# Altium project PCB_Project.PrjPcb
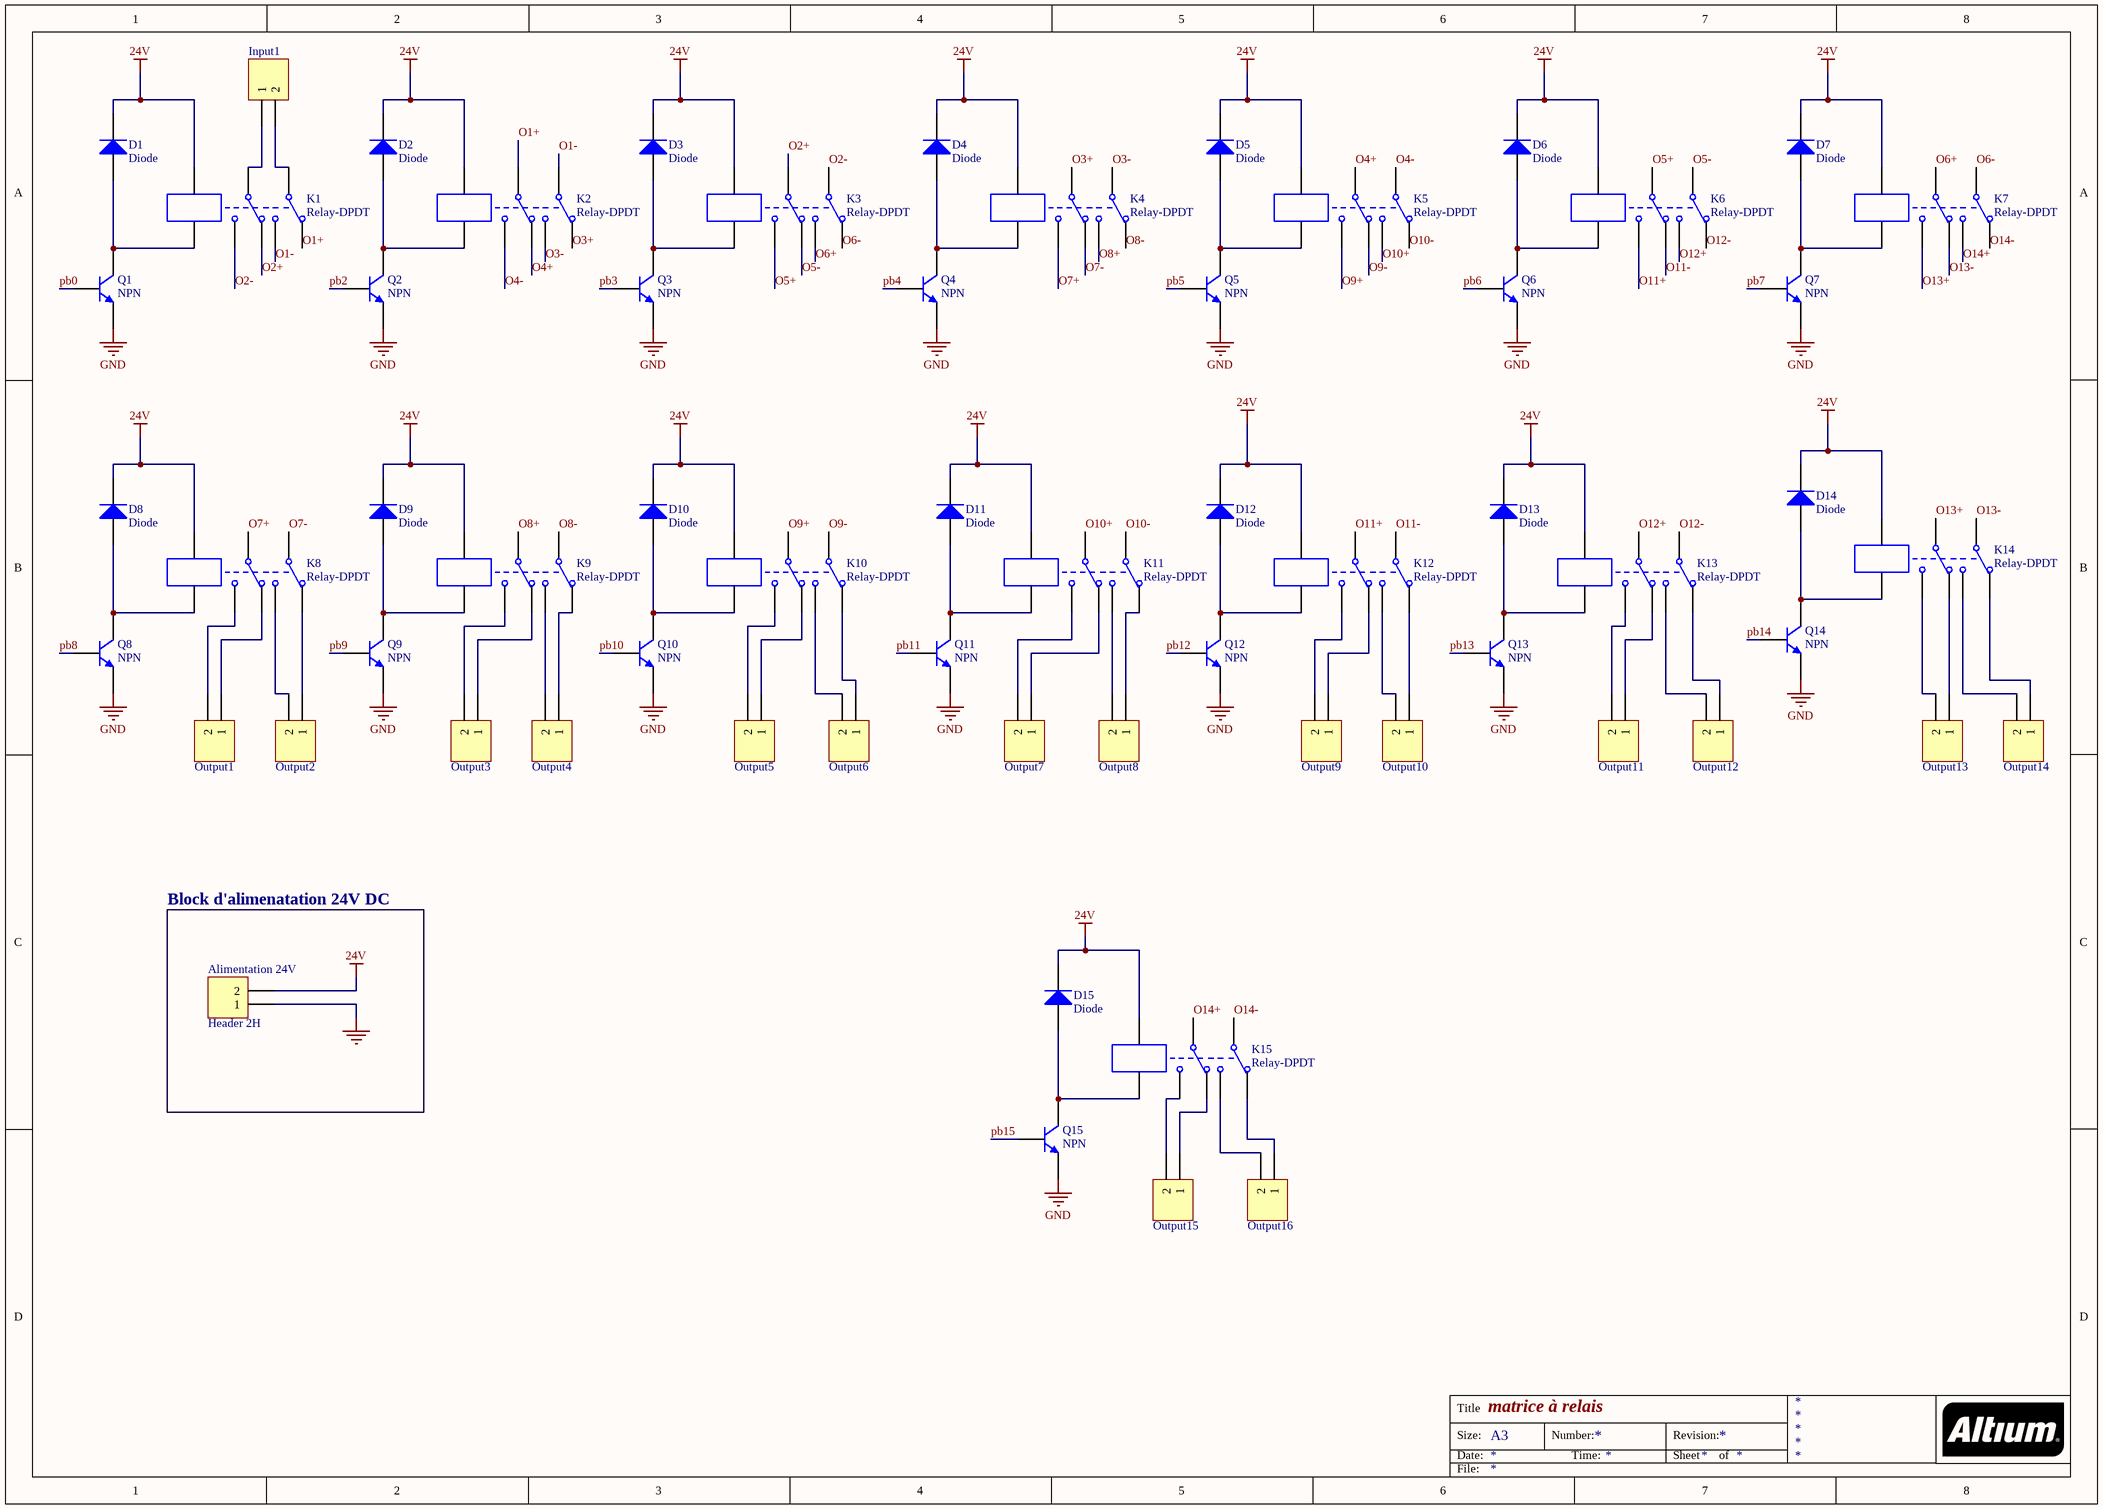
[diagram p0: martice_relais.SchDoc]
4 sheets, 115 parts. Net scope: global (net labels, ports and power ports of the same name join across sheets).
Sheets:
  martice_relais.SchDoc
  MCU.SchDoc
  enc28j60.SchDoc
  MCU2.SchDoc

## Sheet martice_relais.SchDoc: matrice à relais
size A3

### Parts
Alimentation_24V  Header 2H  [HDR1X2H]
D1  Diode  [SMC]
D2  Diode  [SMC]
D3  Diode  [SMC]
D4  Diode  [SMC]
D5  Diode  [SMC]
D6  Diode  [SMC]
D7  Diode  [SMC]
D8  Diode  [SMC]
D9  Diode  [SMC]
D10  Diode  [SMC]
D11  Diode  [SMC]
D12  Diode  [SMC]
D13  Diode  [SMC]
D14  Diode  [SMC]
D15  Diode  [SMC]
Input1  Header 2H  [HDR1X2H]  (value not drawn)
K1  Relay-DPDT  [DIP-P8]
K2  Relay-DPDT  [DIP-P8]
K3  Relay-DPDT  [DIP-P8]
K4  Relay-DPDT  [DIP-P8]
K5  Relay-DPDT  [DIP-P8]
K6  Relay-DPDT  [DIP-P8]
K7  Relay-DPDT  [DIP-P8]
K8  Relay-DPDT  [DIP-P8]
K9  Relay-DPDT  [DIP-P8]
K10  Relay-DPDT  [DIP-P8]
K11  Relay-DPDT  [DIP-P8]
K12  Relay-DPDT  [DIP-P8]
K13  Relay-DPDT  [DIP-P8]
K14  Relay-DPDT  [DIP-P8]
K15  Relay-DPDT  [DIP-P8]
Output1  Header 2H  [HDR1X2H]  (value not drawn)
Output2  Header 2H  [HDR1X2H]  (value not drawn)
Output3  Header 2H  [HDR1X2H]  (value not drawn)
Output4  Header 2H  [HDR1X2H]  (value not drawn)
Output5  Header 2H  [HDR1X2H]  (value not drawn)
Output6  Header 2H  [HDR1X2H]  (value not drawn)
Output7  Header 2H  [HDR1X2H]  (value not drawn)
Output8  Header 2H  [HDR1X2H]  (value not drawn)
Output9  Header 2H  [HDR1X2H]  (value not drawn)
Output10  Header 2H  [HDR1X2H]  (value not drawn)
Output11  Header 2H  [HDR1X2H]  (value not drawn)
Output12  Header 2H  [HDR1X2H]  (value not drawn)
Output13  Header 2H  [HDR1X2H]  (value not drawn)
Output14  Header 2H  [HDR1X2H]  (value not drawn)
Output15  Header 2H  [HDR1X2H]  (value not drawn)
Output16  Header 2H  [HDR1X2H]  (value not drawn)
Q1  NPN  [TO-226-AA]
Q2  NPN  [TO-226-AA]
Q3  NPN  [TO-226-AA]
Q4  NPN  [TO-226-AA]
Q5  NPN  [TO-226-AA]
Q6  NPN  [TO-226-AA]
Q7  NPN  [TO-226-AA]
Q8  NPN  [TO-226-AA]
Q9  NPN  [TO-226-AA]
Q10  NPN  [TO-226-AA]
Q11  NPN  [TO-226-AA]
Q12  NPN  [TO-226-AA]
Q13  NPN  [TO-226-AA]
Q14  NPN  [TO-226-AA]
Q15  NPN  [TO-226-AA]

### Blocks framed on the sheet
Block d'alimenatation 24V DC: Alimentation_24V

### Nets
24V: Alimentation_24V.2 D1.2(K) D2.2(K) D3.2(K) D4.2(K) D5.2(K) D6.2(K) D7.2(K) D8.2(K) D9.2(K) D10.2(K) D11.2(K) D12.2(K) D13.2(K) D14.2(K) D15.2(K) K1.7 K2.7 K3.7 K4.7 K5.7 K6.7 K7.7 K8.7 K9.7 K10.7 K11.7 K12.7 K13.7 K14.7 K15.7
GND: Q1.3(E) Q2.3(E) Q3.3(E) Q4.3(E) Q5.3(E) Q6.3(E) Q7.3(E) Q8.3(E) Q9.3(E) Q10.3(E) Q11.3(E) Q12.3(E) Q13.3(E) Q14.3(E) Q15.3(E)
VCC: Alimentation_24V.1
O1+: K1.2 K2.4
O1-: K1.3 K2.1
O2+: K1.5 K3.4
O2-: K1.6 K3.1
O3+: K2.2 K4.4
O3-: K2.3 K4.1
O4+: K2.5 K5.4
O4-: K2.6 K5.1
O5+: K3.6 K6.4
O5-: K3.5 K6.1
O6+: K3.3 K7.4
O6-: K3.2 K7.1
O7+: K4.6 K8.4
O7-: K4.5 K8.1
O8+: K4.3 K9.4
O8-: K4.2 K9.1
O9+: K5.6 K10.4
O9-: K5.5 K10.1
O10+: K5.3 K11.4
O10-: K5.2 K11.1
O11+: K6.6 K12.4
O11-: K6.5 K12.1
O12+: K6.3 K13.4
O12-: K6.2 K13.1
O13+: K7.6 K14.4
O13-: K7.5 K14.1
O14+: K7.3 K15.4
O14-: K7.2 K15.1
pb0: Q1.2(B)
pb2: Q2.2(B)
pb3: Q3.2(B)
pb4: Q4.2(B)
pb5: Q5.2(B)
pb6: Q6.2(B)
pb7: Q7.2(B)
pb8: Q8.2(B)
pb9: Q9.2(B)
pb10: Q10.2(B)
pb11: Q11.2(B)
pb12: Q12.2(B)
pb13: Q13.2(B)
pb14: Q14.2(B)
pb15: Q15.2(B)
NetD1_1: D1.1(A) K1.8 Q1.1(C)
NetD2_1: D2.1(A) K2.8 Q2.1(C)
NetD3_1: D3.1(A) K3.8 Q3.1(C)
NetD4_1: D4.1(A) K4.8 Q4.1(C)
NetD5_1: D5.1(A) K5.8 Q5.1(C)
NetD6_1: D6.1(A) K6.8 Q6.1(C)
NetD7_1: D7.1(A) K7.8 Q7.1(C)
NetD8_1: D8.1(A) K8.8 Q8.1(C)
NetD9_1: D9.1(A) K9.8 Q9.1(C)
NetD10_1: D10.1(A) K10.8 Q10.1(C)
NetD11_1: D11.1(A) K11.8 Q11.1(C)
NetD12_1: D12.1(A) K12.8 Q12.1(C)
NetD13_1: D13.1(A) K13.8 Q13.1(C)
NetD14_1: D14.1(A) K14.8 Q14.1(C)
NetD15_1: D15.1(A) K15.8 Q15.1(C)
NetInput1_1: Input1.1 K1.4
NetInput1_2: Input1.2 K1.1
NetK8_2: K8.2 Output2.1
NetK8_3: K8.3 Output2.2
NetK8_5: K8.5 Output1.1
NetK8_6: K8.6 Output1.2
NetK9_2: K9.2 Output4.1
NetK9_3: K9.3 Output4.2
NetK9_5: K9.5 Output3.1
NetK9_6: K9.6 Output3.2
NetK10_2: K10.2 Output6.1
NetK10_3: K10.3 Output6.2
NetK10_5: K10.5 Output5.1
NetK10_6: K10.6 Output5.2
NetK11_2: K11.2 Output8.1
NetK11_3: K11.3 Output8.2
NetK11_5: K11.5 Output7.1
NetK11_6: K11.6 Output7.2
NetK12_2: K12.2 Output10.1
NetK12_3: K12.3 Output10.2
NetK12_5: K12.5 Output9.1
NetK12_6: K12.6 Output9.2
NetK13_2: K13.2 Output12.1
NetK13_3: K13.3 Output12.2
NetK13_5: K13.5 Output11.1
NetK13_6: K13.6 Output11.2
NetK14_2: K14.2 Output14.1
NetK14_3: K14.3 Output14.2
NetK14_5: K14.5 Output13.1
NetK14_6: K14.6 Output13.2
NetK15_2: K15.2 Output16.1
NetK15_3: K15.3 Output16.2
NetK15_5: K15.5 Output15.1
NetK15_6: K15.6 Output15.2

### Notes on the sheet
- Title
- Size:
- Date:
- A3
- Number:
- Time:
- Revision:
- Sheet
- of
- File:

### Library data of the parts
Alimentation_24V Input1 Output1-Output16 = Header 2H: Header, 2-Pin, Right Angle; LatestRevisionDate: 17-Jul-2002; LatestRevisionNote: Re-released for DXP Platform.; Publisher: Altium Limited
D1-D15 = Diode: Default Diode; Published: 8-Jun-2000; LatestRevisionDate: 17-Jul-2002; LatestRevisionNote: Re-released for DXP Platform.; PackageVersion: Sep-1996; PackageReference: SMC; Publisher: Altium Limited; PackageDescription: DO-214-AB/SMC; 2 C-Bend Leads; Body 7.9 x 5.9 mm, inc. leads (LxW); Code_JEDEC: DO-214-AB
K1-K15 = Relay-DPDT: Dual-Pole Dual-Throw Relay; Published: 24-Mar-1999; LatestRevisionDate: 17-Jul-2002; LatestRevisionNote: Re-released for DXP Platform.; PackageReference: DIP-P8; Publisher: Altium Limited; PackageDescription: Relay; 8 Leads
Q1-Q15 = NPN: NPN Bipolar Transistor; Published: 8-Jun-2000; LatestRevisionDate: 17-Jul-2002; LatestRevisionNote: Re-released for DXP Platform.; PackageReference: TO-226-AA; Publisher: Altium Limited; PackageDescription: TO, Flat Index; 3 In-Line, Axial Leads; Body Dia. 4.8mm; Leads 0.55 x 0.51 mm (max); Code_JEDEC: TO-226-AA

## Sheet MCU.SchDoc: MCU_STM32F407VGT6
size A3
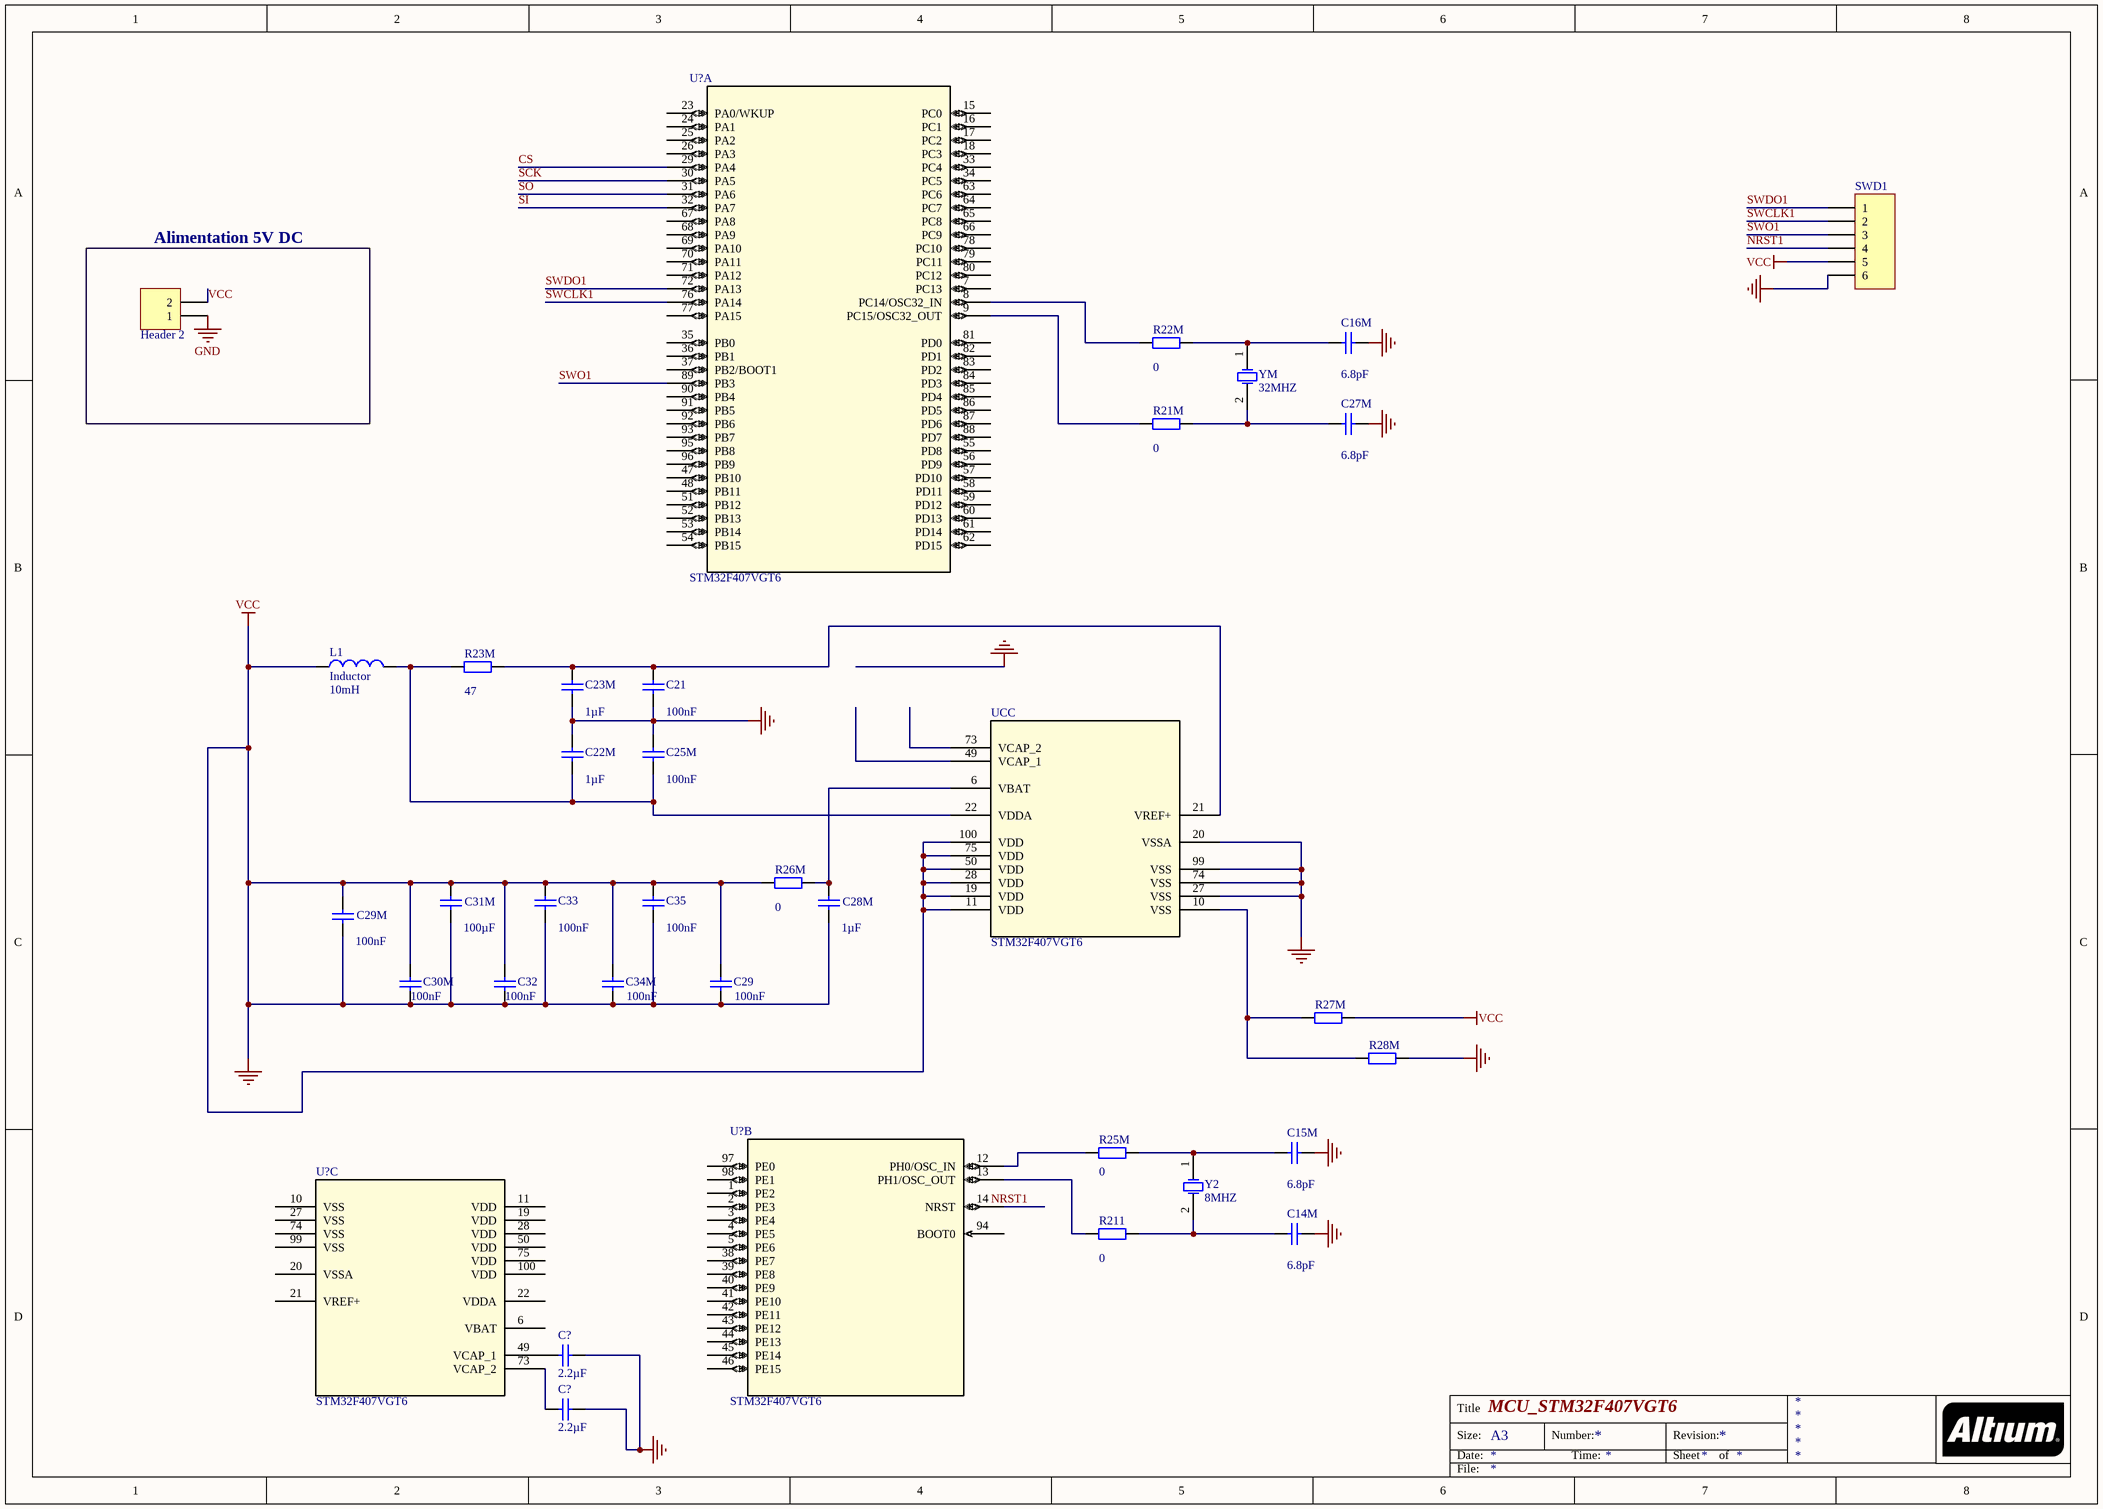
[diagram p1: MCU.SchDoc]

### Parts
(Parts that share a designator on the sheet are numbered #1, #2 ... from top to bottom, then left to right.)
Alimentation_5V_DC  Header 2  [HDR1X2]
C14M  value 6.8pF  [RAD-0.3]  (hidden comment: Cap)
C15M  value 6.8pF  [RAD-0.3]  (hidden comment: Cap)
C16M  value 6.8pF  [RAD-0.3]  (hidden comment: Cap)
C21  value 100nF  [RAD-0.3]  (hidden comment: Cap)
C22M  value 1µF  [RAD-0.3]  (hidden comment: Cap)
C23M  value 1µF  [RAD-0.3]  (hidden comment: Cap)
C25M  value 100nF  [RAD-0.3]  (hidden comment: Cap)
C27M  value 6.8pF  [RAD-0.3]  (hidden comment: Cap)
C28M  value 1µF  [RAD-0.3]  (hidden comment: Cap)
C29  value 100nF  [RAD-0.3]  (hidden comment: Cap)
C29M  value 100nF  [RAD-0.3]  (hidden comment: Cap)
C30M  value 100nF  [RAD-0.3]  (hidden comment: Cap)
C31M  value 100µF  [RAD-0.3]  (hidden comment: Cap)
C32  value 100nF  [RAD-0.3]  (hidden comment: Cap)
C33  value 100nF  [RAD-0.3]  (hidden comment: Cap)
C34M  value 100nF  [RAD-0.3]  (hidden comment: Cap)
C35  value 100nF  [RAD-0.3]  (hidden comment: Cap)
C?#1  value 2.2µF  [RAD-0.3]  (hidden comment: Cap)
C?#2  value 2.2µF  [RAD-0.3]  (hidden comment: Cap)
L1  Inductor  value 10mH  [0402-A]
R21M  value 0  [AXIAL-0.4]  (hidden comment: Res2)
R22M  value 0  [AXIAL-0.4]  (hidden comment: Res2)
R23M  value 47  [AXIAL-0.4]  (hidden comment: Res2)
R25M  value 0  [AXIAL-0.4]  (hidden comment: Res2)
R26M  value 0  [AXIAL-0.4]  (hidden comment: Res2)
R27M  Res2  [AXIAL-0.4]  (value not drawn)
R28M  Res2  [AXIAL-0.4]  (value not drawn)
R211  value 0  [AXIAL-0.4]  (hidden comment: Res2)
SWD1  Header 6H  [HDR1X6H]  (value not drawn)
U?#1  STM32F407VGT6  [LQFP100-14x14mm]  (part A of 3)
U?#2  STM32F407VGT6  [LQFP100-14x14mm]  (part B of 3)
U?#3  STM32F407VGT6  [LQFP100-14x14mm]  (part C of 3)
UC  STM32F407VGT6  [LQFP100-14x14mm]  (part C of 3)
Y2  8MHZ  [R38]
YM  32MHZ  [R38]

### Nets
GND: Alimentation_5V_DC.1
VCC: Alimentation_5V_DC.2 C14M.1 C15M.1 C16M.1 C21.1 C22M.2 C23M.1 C25M.2 C27M.1 C28M.1 C29.1 C29.2 C29M.1 C29M.2 C30M.1 C30M.2 C31M.1 C31M.2 C32.1 C32.2 C33.1 C33.2 C34M.1 C34M.2 C35.1 C35.2 C?#1.1 C?#2.1 L1.1 R26M.1 R27M.2 R28M.1 SWD1.5 SWD1.6 UC.11(VDD) UC.19(VDD) UC.20(VSSA) UC.27(VSS) UC.28(VDD) UC.50(VDD) UC.74(VSS) UC.75(VDD) UC.99(VSS) UC.100(VDD)
CS: U?#1.29(PA4)
NRST1: SWD1.4
SCK: U?#1.30(PA5)
SI: U?#1.32(PA7)
SO: U?#1.31(PA6)
SWCLK1: SWD1.2 U?#1.76(PA14)
SWDO1: SWD1.1 U?#1.72(PA13)
SWO1: SWD1.3 U?#1.89(PB3)
NetC14M_2: C14M.2 R211.2 Y2.2(OSC2)
NetC15M_2: C15M.2 R25M.2 Y2.1(OSC1)
NetC16M_2: C16M.2 R22M.2 YM.1(OSC1)
NetC21_2: C21.2 C23M.2 R23M.2 UC.21(VREF+)
NetC22M_1: C22M.1 C25M.1 L1.2 R23M.1 UC.22(VDDA)
NetC27M_2: C27M.2 R21M.2 YM.2(OSC2)
NetC28M_2: C28M.2 R26M.2 UC.6(VBAT)
NetC?#1_2: C?#1.2 U?#3.49(VCAP_1)
NetC?#2_2: C?#2.2 U?#3.73(VCAP_2)
NetR21M_1: R21M.1 U?#1.9(PC15/OSC32_OUT)
NetR22M_1: R22M.1 U?#1.8(PC14/OSC32_IN)
NetR25M_1: R25M.1 U?#2.12(PH0/OSC_IN)
NetR27M_1: R27M.1 R28M.2 UC.10(VSS)
NetR211_1: R211.1 U?#2.13(PH1/OSC_OUT)

Not connected (* = marked no-connect by the designer): U?#1 7(PC13) 15(PC0) 16(PC1) 17(PC2) 18(PC3) 23(PA0/WKUP) 24(PA1) 25(PA2) 26(PA3) 33(PC4) 34(PC5) 35(PB0) 36(PB1) 37(PB2/BOOT1) 47(PB10) 48(PB11) 51(PB12) 52(PB13) 53(PB14) 54(PB15) 55(PD8) 56(PD9) 57(PD10) 58(PD11) 59(PD12) 60(PD13) 61(PD14) 62(PD15) 63(PC6) 64(PC7) 65(PC8) 66(PC9) 67(PA8) 68(PA9) 69(PA10) 70(PA11) 71(PA12) 77(PA15) 78(PC10) 79(PC11) 80(PC12) 81(PD0) 82(PD1) 83(PD2) 84(PD3) 85(PD4) 86(PD5) 87(PD6) 88(PD7) 90(PB4) 91(PB5) 92(PB6) 93(PB7) 95(PB8) 96(PB9); U?#2 1(PE2) 2(PE3) 3(PE4) 4(PE5) 5(PE6) 14(NRST) 38(PE7) 39(PE8) 40(PE9) 41(PE10) 42(PE11) 43(PE12) 44(PE13) 45(PE14) 46(PE15) 94(BOOT0) 97(PE0) 98(PE1); U?#3 6(VBAT) 10(VSS) 11(VDD) 19(VDD) 20(VSSA) 21(VREF+) 22(VDDA) 27(VSS) 28(VDD) 50(VDD) 74(VSS) 75(VDD) 99(VSS) 100(VDD); UC 49(VCAP_1) 73(VCAP_2)

### Notes on the sheet
- Labels drawn without touching a wire or pin: NRST1
- Title
- Size:
- Date:
- A3
- Number:
- Time:
- Revision:
- Sheet
- of
- File:

### Library data of the parts
Alimentation_5V_DC = Header 2: Header, 2-Pin; LatestRevisionDate: 17-Jul-2002; LatestRevisionNote: Re-released for DXP Platform.; Publisher: Altium Limited
C14M C15M C16M C21 C22M C23M C25M C27M C28M C29 C29M C30M C31M C32 C33 C34M C35 C?#1 C?#2 = Cap: Capacitor; Published: 8-Jun-2000; LatestRevisionDate: 17-Jul-2002; LatestRevisionNote: Re-released for DXP Platform.; PackageReference: RAD-0.3; Publisher: Altium Limited; PackageDescription: Radial Cap, Thru-Hole; 2 Leads; 0.3 in Pin Spacing
L1 = Inductor: Code_IEC: 1005; Published: 8-Jun-2000; LatestRevisionDate: 29-May-2009; LatestRevisionNote: IPC-7351 Footprint Added.; PackageReference: 0402-A; Publisher: Altium Limited; PackageDescription: Chip Inductor; Code_JEITA: 0402
R21M R22M R23M R25M R26M R27M R28M R211 = Res2: Resistor; Published: 8-Jun-2000; LatestRevisionDate: 17-Jul-2002; LatestRevisionNote: Re-released for DXP Platform.; PackageReference: AXIAL-0.4; Publisher: Altium Limited; PackageDescription: Axial Device, Thru-Hole; 2 Leads; 0.4 in Pin Spacing
SWD1 = Header 6H: Header, 6-Pin, Right Angle; LatestRevisionDate: 17-Jul-2002; LatestRevisionNote: Re-released for DXP Platform.; Publisher: Altium Limited
U?#1-U?#3 UC = STM32F407VGT6: No Description Available; Mfr_Name: STMicroelectronics; RefDes: RefDes; Type: Type
Y2 YM = XTAL: Crystal Oscillator; Published: 8-Jun-2000; LatestRevisionDate: 17-Jul-2002; LatestRevisionNote: Re-released for DXP Platform.; PackageReference: R38; Publisher: Altium Limited; PackageDescription: Crystal, Thru-Hole; 2 Leads; Body 3.1 x 8.2 mm (Dia.xH)

## Sheet enc28j60.SchDoc: ENC28J60
size A3
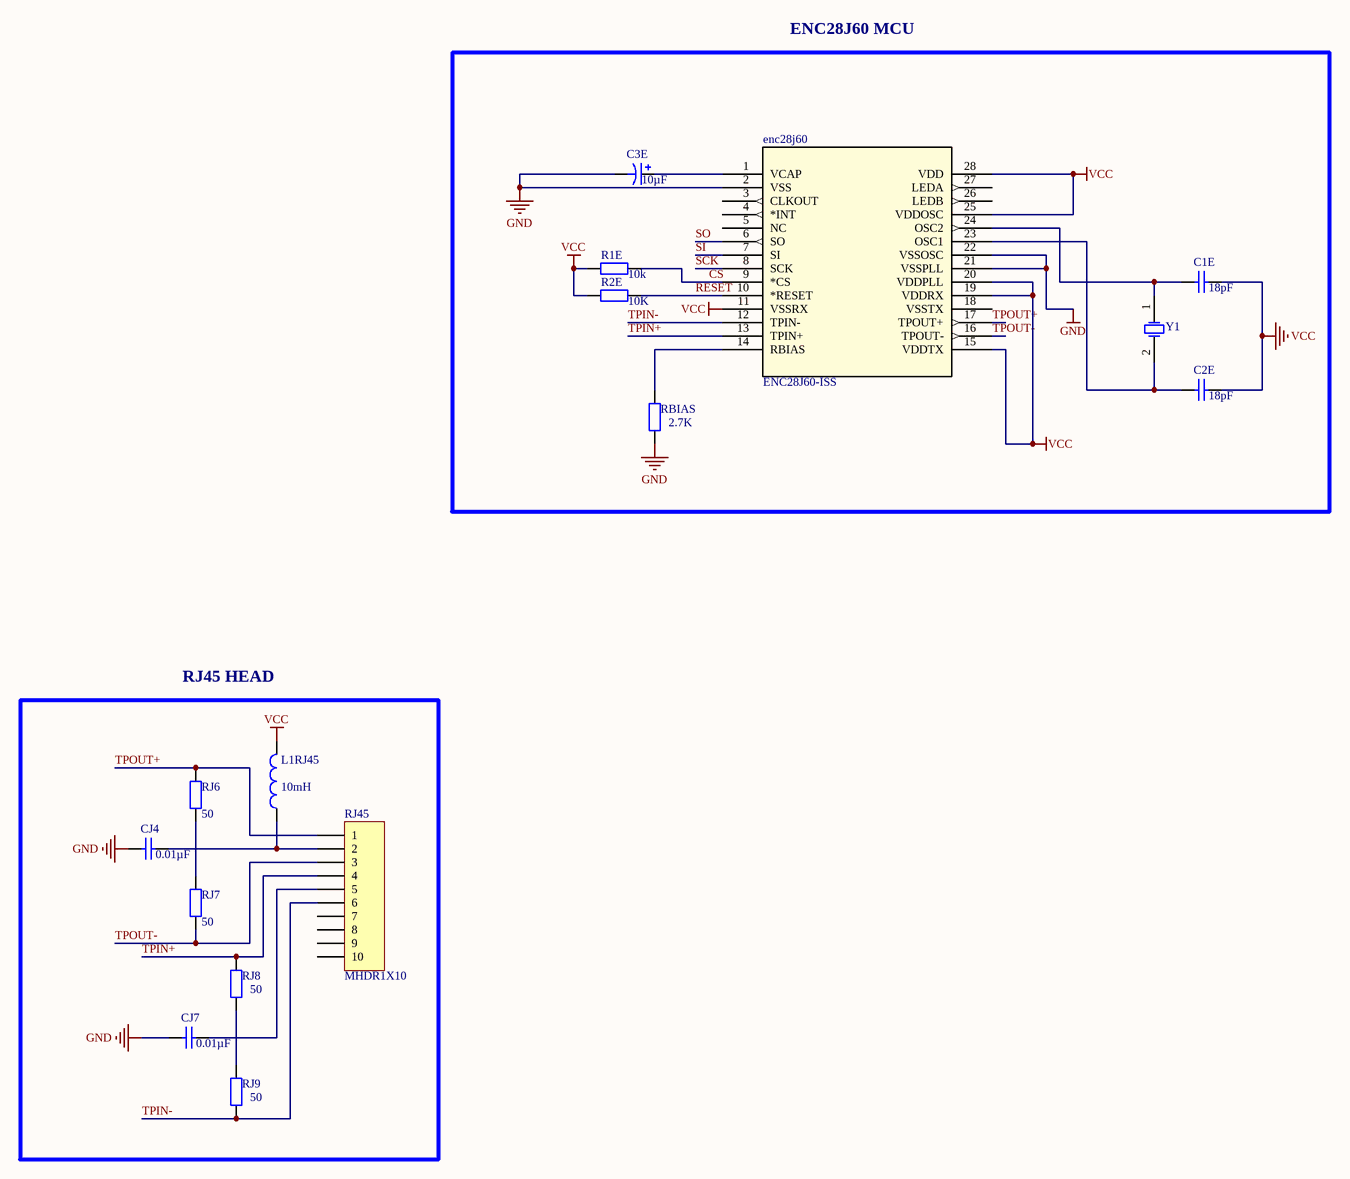
[diagram p2: enc28j60.SchDoc]

### Parts
C1E  value 18pF  [RAD-0.3]  (hidden comment: Cap)
C2E  value 18pF  [RAD-0.3]  (hidden comment: Cap)
C3E  value 10µF  [RB7.6-15]
CJ4  value 0.01µF  [RAD-0.3]  (hidden comment: Cap)
CJ7  value 0.01µF  [RAD-0.3]  (hidden comment: Cap)
enc28j60  ENC28J60-ISS  [SSOP28_MC_MCH]
L1RJ45  value 10mH  [0402-A]  (hidden comment: Inductor)
R1E  value 10k  [AXIAL-0.4]
R2E  value 10K  [AXIAL-0.4]
RBIAS  value 2.7K  [AXIAL-0.4]
RJ6  value 50  [AXIAL-0.4]
RJ7  value 50  [AXIAL-0.4]
RJ8  value 50  [AXIAL-0.4]
RJ9  value 50  [AXIAL-0.4]
RJ45  MHDR1X10  [MHDR1X10]
Y1  XTAL  [R38]  (value not drawn)

### Blocks framed on the sheet
ENC28J60 MCU: C1E C2E C3E enc28j60 R1E R2E RBIAS Y1
RJ45 HEAD: CJ4 CJ7 L1RJ45 RJ6-RJ9 RJ45

### Nets
GND: C3E.2 CJ4.1 CJ7.1 enc28j60.2(VSS) enc28j60.21(VSSPLL) enc28j60.22(VSSOSC) RBIAS.1
VCC: C1E.2 C2E.2 enc28j60.11(VSSRX) enc28j60.15(VDDTX) enc28j60.19(VDDRX) enc28j60.20(VDDPLL) enc28j60.25(VDDOSC) enc28j60.28(VDD) L1RJ45.2 R1E.1 R2E.1
CS: enc28j60.9(*CS) R1E.2
RESET: enc28j60.10(*RESET) R2E.2
SCK: enc28j60.8(SCK)
SI: enc28j60.7(SI)
SO: enc28j60.6(SO)
TPIN+: enc28j60.13(TPIN+) RJ8.2 RJ45.4
TPIN-: enc28j60.12(TPIN-) RJ9.1 RJ45.6
TPOUT+: enc28j60.17(TPOUT+) RJ6.2 RJ45.1
TPOUT-: enc28j60.16(TPOUT-) RJ7.1 RJ45.3
NetC1E_1: C1E.1 enc28j60.24(OSC2) Y1.1(OSC1)
NetC2E_1: C2E.1 enc28j60.23(OSC1) Y1.2(OSC2)
NetC3E_1: C3E.1 enc28j60.1(VCAP)
NetCJ4_2: CJ4.2 L1RJ45.1 RJ45.2
NetCJ7_2: CJ7.2 RJ45.5
Netenc28j60_14: enc28j60.14(RBIAS) RBIAS.2
NetRJ6_1: RJ6.1 RJ7.2
NetRJ8_1: RJ8.1 RJ9.2

Not connected (* = marked no-connect by the designer): enc28j60 3(CLKOUT) 4(*INT) 5(NC) 18(VSSTX) 26(LEDB) 27(LEDA); RJ45 7 8 9 10

### Notes on the sheet
- Title
- Size:
- Date:
- A
- Number:
- Time:
- Revision:
- Sheet
- of
- File:

### Library data of the parts
C1E C2E CJ4 CJ7 = Cap: Capacitor; Published: 8-Jun-2000; LatestRevisionDate: 17-Jul-2002; LatestRevisionNote: Re-released for DXP Platform.; PackageReference: RAD-0.3; Publisher: Altium Limited; PackageDescription: Radial Cap, Thru-Hole; 2 Leads; 0.3 in Pin Spacing
C3E = Cap Pol1: Polarized Capacitor (Radial); Published: 8-Jun-2000; LatestRevisionDate: 17-Jul-2002; LatestRevisionNote: Re-released for DXP Platform.; PackageReference: RB7.6-15; Publisher: Altium Limited; PackageDescription: Polarized Capacitor (Radial); 2 Leads
enc28j60 = ENC28J60-ISS: No Description Available; Mfr_Name: Microchip; RefDes: RefDes; Type: Type
L1RJ45 = Inductor: Code_IEC: 1005; Published: 8-Jun-2000; LatestRevisionDate: 29-May-2009; LatestRevisionNote: IPC-7351 Footprint Added.; PackageReference: 0402-A; Publisher: Altium Limited; PackageDescription: Chip Inductor; Code_JEITA: 0402
R1E R2E RBIAS RJ6-RJ9 = Res2: Resistor; Published: 8-Jun-2000; LatestRevisionDate: 17-Jul-2002; LatestRevisionNote: Re-released for DXP Platform.; PackageReference: AXIAL-0.4; Publisher: Altium Limited; PackageDescription: Axial Device, Thru-Hole; 2 Leads; 0.4 in Pin Spacing
RJ45 = MHDR1X10: Header, 10-Pin; LatestRevisionDate: 17-Jul-2002; LatestRevisionNote: Re-released for DXP Platform.; Publisher: Altium Limited
Y1 = XTAL: Crystal Oscillator; Published: 8-Jun-2000; LatestRevisionDate: 17-Jul-2002; LatestRevisionNote: Re-released for DXP Platform.; PackageReference: R38; Publisher: Altium Limited; PackageDescription: Crystal, Thru-Hole; 2 Leads; Body 3.1 x 8.2 mm (Dia.xH)

## Sheet MCU2.SchDoc: MCU_STM32F407VGT6
size A3

### Notes on the sheet
- Title
- Size:
- Date:
- A3
- Number:
- Time:
- Revision:
- Sheet
- of
- File:

## Nets that join several sheets
GND: martice_relais (15 pins), MCU (Alimentation_5V_DC.1), enc28j60 (7 pins)
VCC: martice_relais (Alimentation_24V.1), MCU (44 pins), enc28j60 (11 pins)
CS: MCU (U?#1.29), enc28j60 (enc28j60.9 R1E.2)
SCK: MCU (U?#1.30), enc28j60 (enc28j60.8)
SI: MCU (U?#1.32), enc28j60 (enc28j60.7)
SO: MCU (U?#1.31), enc28j60 (enc28j60.6)